# EAGLE design barometer-throughhole (EAGLE 7.0.0)
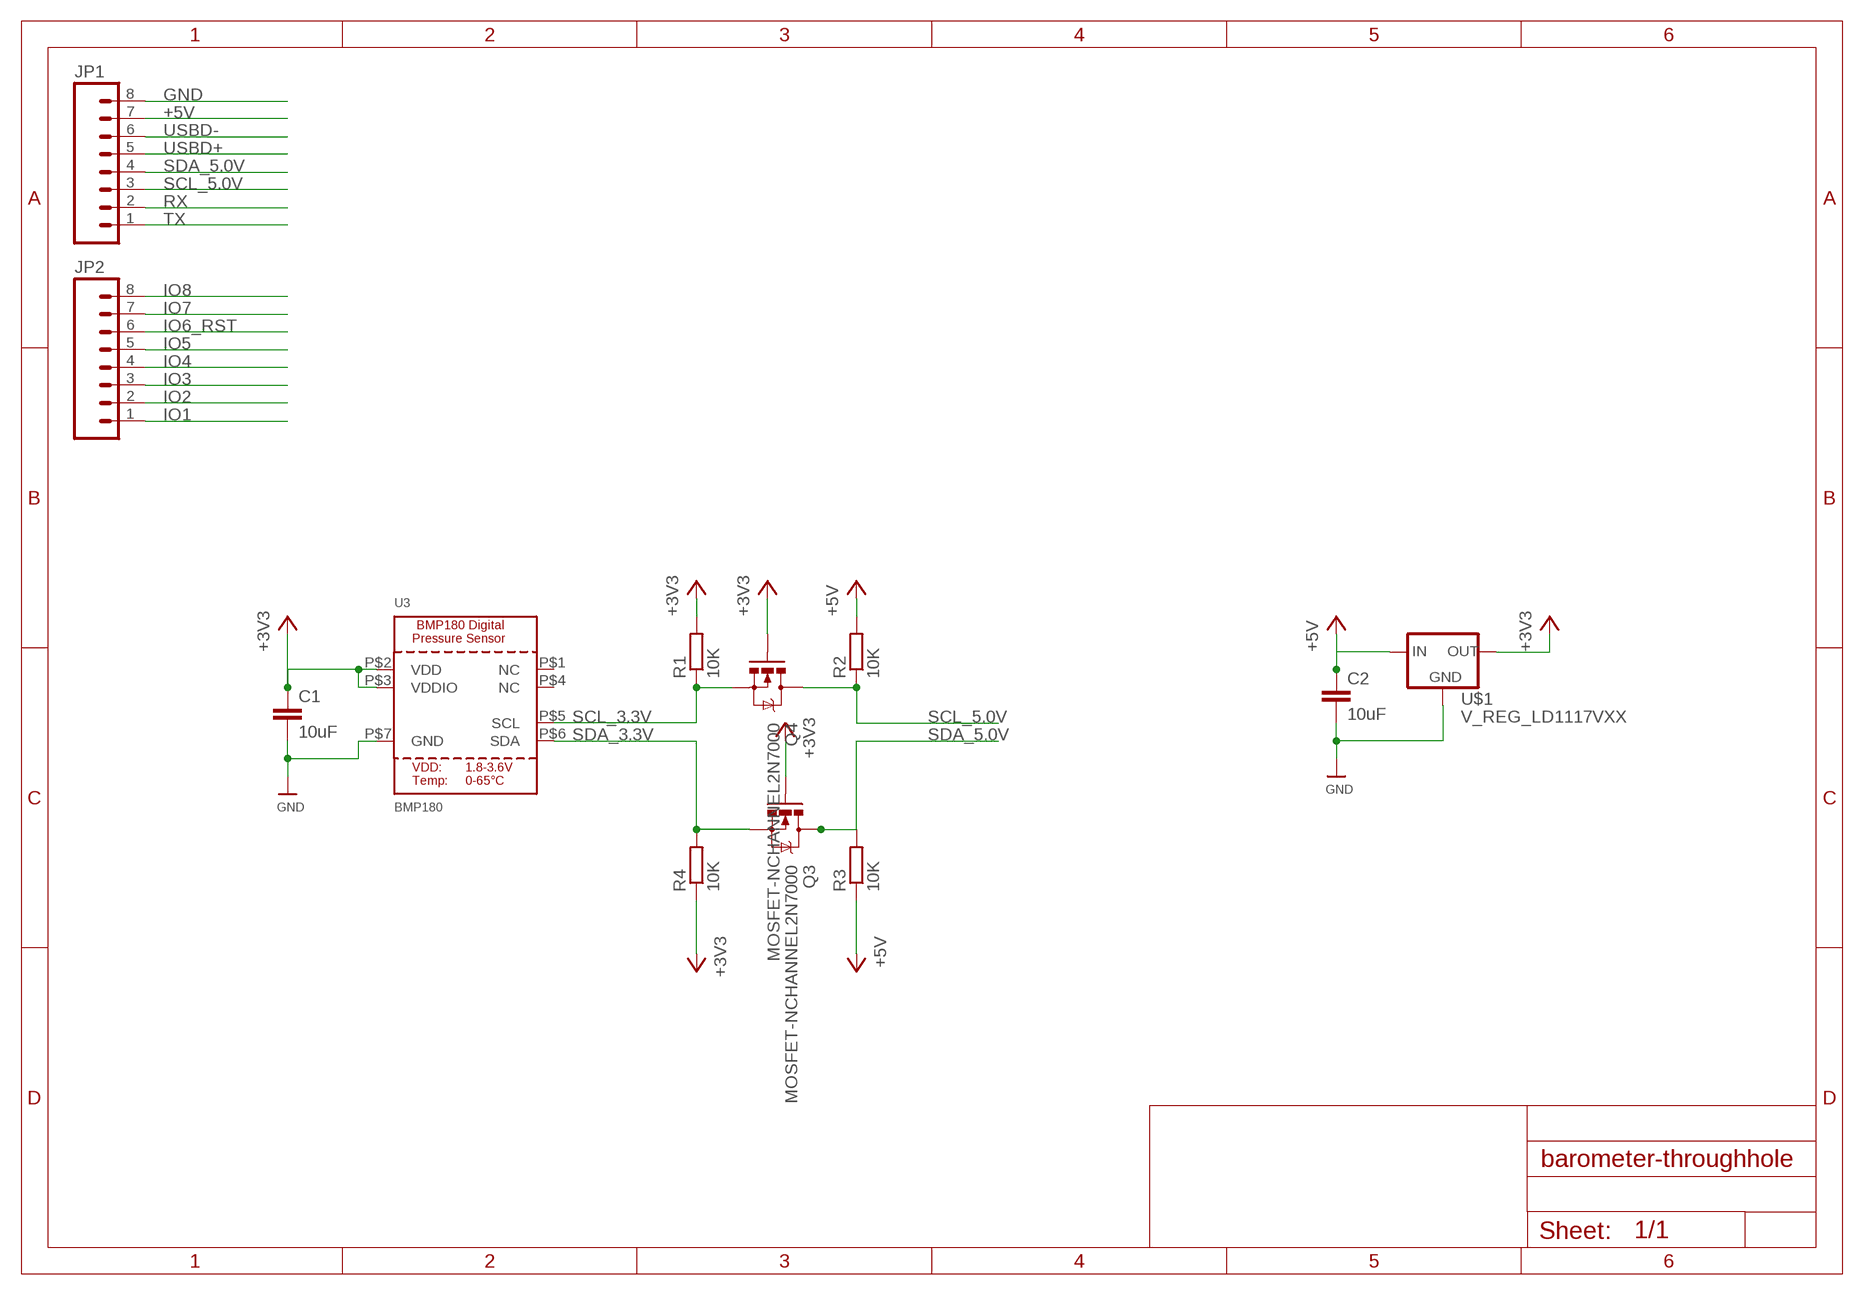
[diagram p0: schematic, sheet 1]

## Parts
C1  10uF  C-EU025-030X050  [C025-030X050]
C2  10uF  C-EU025-030X050  [C025-030X050]
JP1  M081X08  [1X08]
JP2  M081X08  [1X08]
Q3  MOSFET-NCHANNEL2N7000  [TO-92]
Q4  MOSFET-NCHANNEL2N7000  [TO-92]
R1  10K  R-EU_0204/7  [0204/7]
R2  10K  R-EU_0204/7  [0204/7]
R3  10K  R-EU_0204/7  [0204/7]
R4  10K  R-EU_0204/7  [0204/7]
U3  BMP180  BMP180EXT  [BMP180_EXTENDED]
U$1  V_REG_LD1117VXX  [78XXL]

## Nets
+3V3: C1.1 Q3.2(G) Q4.2(G) R1.2 R4.1 U3.P$2(VDD) U3.P$3(VDDIO) U$1.GND(OUT)
+5V: C2.1 JP1.7 R2.2 R3.1 U$1.OUT(IN)
GND: C1.2 C2.2 JP1.8 U3.P$7(GND) U$1.IN(GND)
IO1: JP2.1
IO2: JP2.2
IO3: JP2.3
IO4: JP2.4
IO5: JP2.5
IO6_RST: JP2.6
IO7: JP2.7
IO8: JP2.8
RX: JP1.2
SCL_3.3V: Q4.1(S) R1.1 U3.P$5(SCL)
SCL_5.0V: JP1.3 Q4.3(D) R2.1
SDA_3.3V: Q3.1(S) R4.2 U3.P$6(SDA)
SDA_5.0V: JP1.4 Q3.3(D) R3.2
TX: JP1.1
USBD+: JP1.5
USBD-: JP1.6
Unconnected: U3.P$1(NC) U3.P$4(NC)

## Library data of the parts
C1 C2 = rcl:C-EU: CAPACITOR, European symbol
JP1 JP2 = SparkFun-Connectors:M08: Header 8 Standard 8-pin 0.1" header. Use with straight break away headers (SKU : PRT-00116), right angle break away headers (PRT-00553), swiss pins (PRT-00743), machine pins (PRT-00117), and female headers (PRT-00115).
Q3 Q4 = SparkFun-DiscreteSemi:MOSFET-NCHANNEL: Common NMOSFET Parts MFG P/N Store ID Prod ID FDD8780 TRANS-09984 SI7820DN TRANS-11055 FDS6630A IC-08089 2N7002PW TRANS-11151 FQP30N06L COM-10213 TRANS-10060 BSS123LT1G TRANS-08345 BSS138 TRANS-00830 BS170 2N7000
R1-R4 = rcl:R-EU_: RESISTOR, European symbol
U3 = microbuilder:BMP180: BMP180 Digital Pressure Sensor 1.8-3.6V Supply, I2C Interface
U$1 = SparkFun-PowerIC:V_REG_LD1117VXX: LD1117VXX voltage regulator. We carry the 3.3V version (COM-00526) in TO-220 package.

## Board
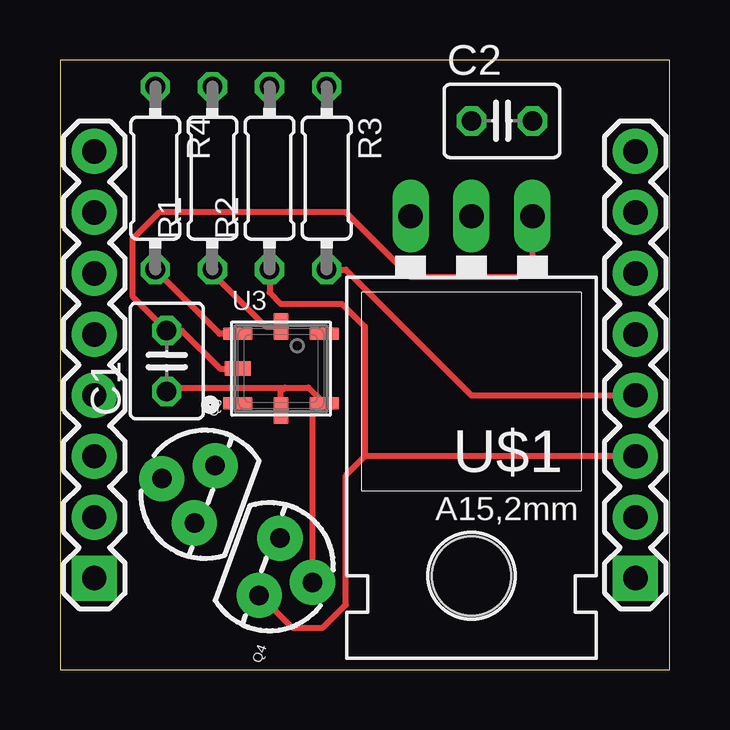
[diagram p1: board, top side]
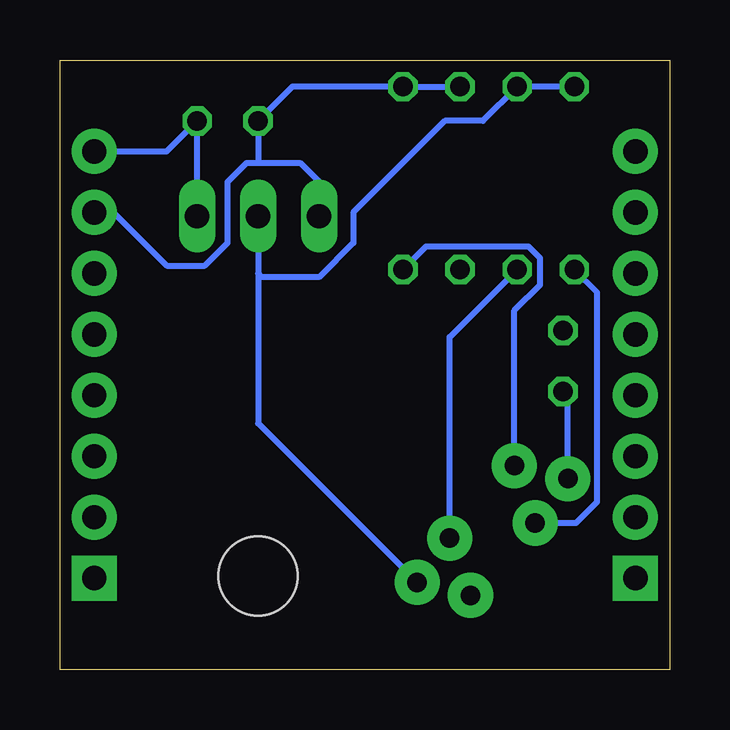
[diagram p2: board, bottom side, seen from below]

Size 25.4 x 25.4 mm. Coordinates in mm from the lower left corner, seen from the top.
Outline: 0,0 25.4,0 25.4,25.4 0,25.4 0,0
Copper layers (1*16): Top 0.0356mm / dielectric 1.5011mm / Bottom 0.0356mm
Design rules "LaenPCBOrder": minimum track width 6mil, minimum drill 13mil, track to track 6mil, track to pad 6mil, pad to pad 6mil, via to via 6mil, smd to smd 6mil, copper to edge 15mil, drill to drill 6mil, minimum pad ring 7mil, minimum via ring 7mil, stop-mask expansion 3mil, vias tented up to drill 0mil, thermal gap 10mil

### Footprints (pad centres in the part's own frame; a part is rotated, then mirrored left to right if it is on the bottom)
C025-030X050 = drill 0.813 octagon: 1 -1.27,0; 2 1.27,0
1X08 = drill 1.016 pad 1.88 square: 1 0,0 | drill 1.016 pad 1.88: 2 2.54,0; 3 5.08,0; 4 7.62,0; 5 10.16,0; 6 12.7,0; 7 15.24,0; 8 17.78,0
TO-92 = drill 0.813 pad 1.88: 1 -1.27,0; 2 0,1.905; 3 1.27,0
0204/7 = drill 0.813 octagon: 1 -3.81,0; 2 3.81,0
BMP180_EXTENDED = smd 1.2 x 0.5: P$1 -1.8,-1.45; P$3 1.8,-1.45; P$4 1.8,1.45; P$6 -1.8,1.45 | smd 0.6 x 1.1: P$2 0,-1.75; P$5 0,1.75 | smd 1.1 x 0.6: P$7 -1.8,0
78XXL = drill 1.016 long: GND 0,-3.81; IN -2.54,-3.81; OUT 2.54,-3.81 | hole 3.302: 0,11.176

### Placement (x,y rotation side)
C1  4.45,12.86 90 top
C2  18.41,22.86 0 top
JP1  23.97,3.81 90 top
JP2  1.43,3.81 90 top
Q3  6.03,7.3 70 top
Q4  8.73,4.29 250 top
R1  6.35,20.48 90 top
R2  8.73,20.48 90 top
R3  11.11,20.48 270 top
R4  3.97,20.48 270 top
U3  9.21,12.54 0 top
U$1  17.14,15.08 180 top

### Tracks (layer width: path | path; a pad name or v marks a point on that pad's centre or on a via)
+3V3
  Top 0.254: C1.1 4.6,11.59 4.76,11.75 9.37,11.75 | 9.37,11.75 10.35,11.75 U3.P$3 10.52,10.61 Q4.2 | U3.P$2 9.21,11.59 9.37,11.75
  Bottom 0.254: Q3.2 4.24,11.39 C1.1 | U$1.GND 17.14,16.51 | 17.14,16.51 17.14,10.26 Q4.2 | R4.1 R1.2 7.78,22.86 9.37,22.86 13.18,19.05 13.18,17.78 14.61,16.35 16.99,16.35 17.14,16.51
+5V
  Bottom 0.254: JP1.7 23.18,19.05 20.95,16.83 19.37,16.83 18.41,17.78 18.41,20.32 17.62,21.11 17.14,21.11 | 17.14,21.11 15.4,21.11 14.61,20.32 U$1.OUT | 17.14,21.11 C2.1 15.72,24.29 R3.1 R2.2
GND
  Top 0.254: U3.P$7 6.67,12.54 5.08,14.13 C1.2 3.02,15.56 3.02,17.94 4.13,19.05 11.91,19.05 14.61,16.35 19.05,16.35 19.68,16.99 U$1.IN
  Bottom 0.254: U$1.IN C2.2 20.95,21.59 JP1.8
SCL_3.3V
  Top 0.254: R1.1 6.35,16.51 8.57,14.29 U3.P$5
  Bottom 0.254: Q4.1 9.17,13.85 R1.1
SCL_5.0V
  Top 0.254: Q4.3 8.34,3.09 9.68,1.75 10.95,1.75 11.91,2.7 11.91,8.1 12.7,8.89 | R2.1 8.73,15.72 9.21,15.24 11.75,15.24 12.7,14.29 12.7,8.89 | JP1.3 12.7,8.89
SDA_3.3V
  Top 0.254: U3.P$6 6.65,13.99 R4.2
  Bottom 0.254: Q3.1 3.89,6.11 3.02,6.99 3.02,15.72 R4.2
SDA_5.0V
  Top 0.254: R3.2 11.91,16.67 17.14,11.43 JP1.4
  Bottom 0.254: R3.2 10.16,17.62 5.87,17.62 5.4,17.14 5.4,16.03 6.47,14.96 Q3.3